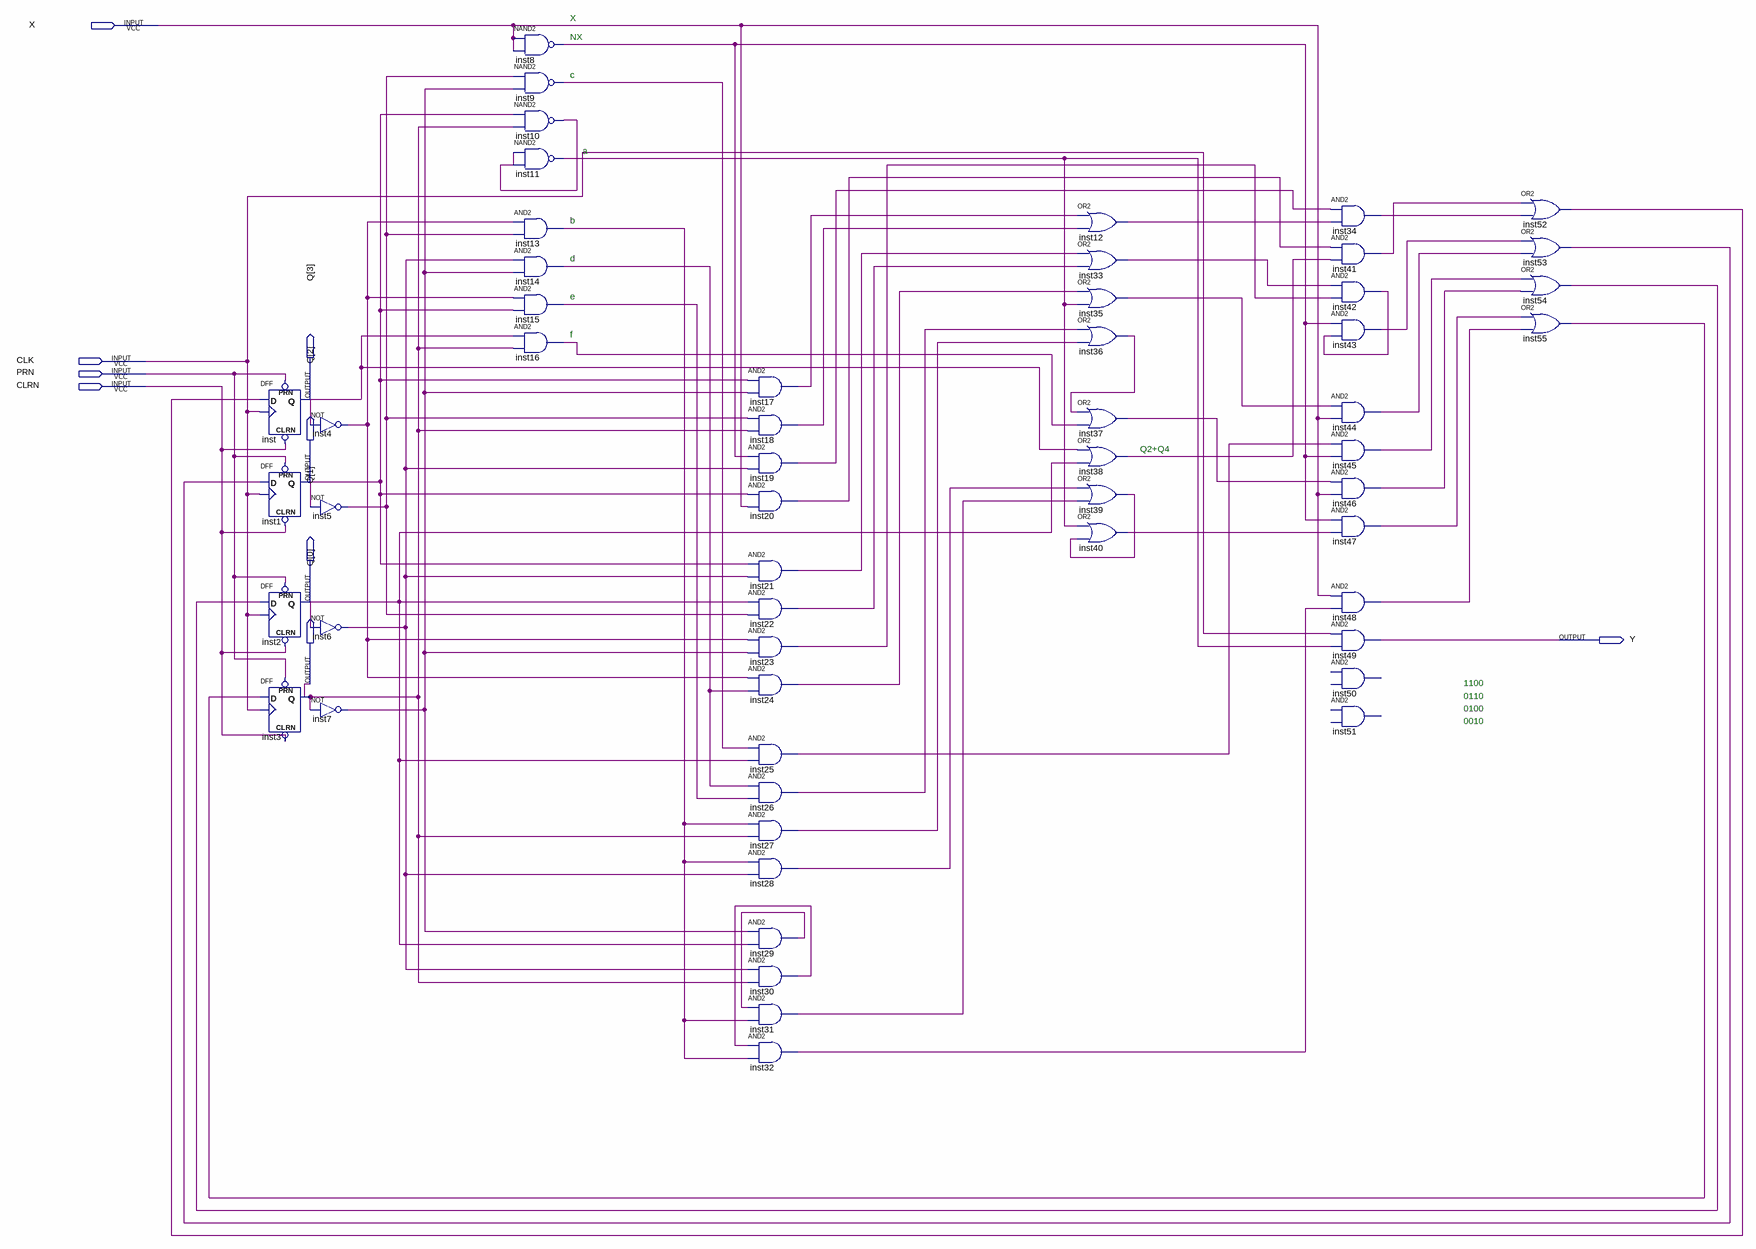
[diagram p0: schematic sheet]
// Quartus schematic lab_work2_v4_COURSE_WORK_STATE_MACHINE.bdf as structural Verilog: 56 symbols, 9 pins
module lab_work2_v4_COURSE_WORK_STATE_MACHINE (
  input  X,
  input  CLK,
  input  PRN,
  input  CLRN,
  output [3:0] Q,
  output Y
);

  wire inst4_out, inst5_out, inst6_out, inst7_out, inst8_out, inst9_out, inst10_out, inst11_out, inst12_out,
       inst13_out, inst14_out, inst15_out, inst16_out, inst17_out, inst18_out, inst19_out, inst20_out,
       inst21_out, inst22_out, inst23_out, inst24_out, inst25_out, inst26_out, inst27_out, inst28_out,
       inst29_out, inst30_out, inst31_out, inst32_out, inst33_out, inst34_out, inst35_out, inst36_out,
       inst37_out, inst38_out, inst39_out, inst40_out, inst41_out, inst42_out, inst43_out, inst44_out,
       inst45_out, inst46_out, inst47_out, inst48_out, inst52_out, inst53_out, inst54_out, inst55_out;

  DFF inst (.CLRN(CLRN), .CLK(CLK), .D(inst52_out), .PRN(PRN), .Q(Q[3]));
  DFF inst1 (.CLRN(CLRN), .CLK(CLK), .D(inst53_out), .PRN(PRN), .Q(Q[2]));
  DFF inst2 (.CLRN(CLRN), .CLK(CLK), .D(inst54_out), .PRN(PRN), .Q(Q[1]));
  DFF inst3 (.CLRN(CLRN), .CLK(CLK), .D(inst55_out), .PRN(PRN), .Q(Q[0]));
  not inst4 (inst4_out, Q[3]);
  not inst5 (inst5_out, Q[2]);
  not inst6 (inst6_out, Q[1]);
  not inst7 (inst7_out, Q[0]);
  nand inst8 (inst8_out, X, X);
  nand inst9 (inst9_out, inst5_out, inst7_out);
  nand inst10 (inst10_out, Q[2], Q[0]);
  nand inst11 (inst11_out, inst10_out, inst10_out);
  and inst13 (inst13_out, inst4_out, inst5_out);
  and inst14 (inst14_out, inst6_out, inst7_out);
  and inst15 (inst15_out, inst4_out, Q[2]);
  and inst16 (inst16_out, Q[3], Q[0]);
  and inst17 (inst17_out, Q[2], inst7_out);
  and inst18 (inst18_out, inst5_out, Q[0]);
  and inst19 (inst19_out, inst8_out, inst6_out);
  and inst20 (inst20_out, Q[2], X);
  and inst21 (inst21_out, Q[2], inst6_out);
  and inst22 (inst22_out, Q[1], inst5_out);
  and inst23 (inst23_out, inst4_out, inst7_out);
  and inst24 (inst24_out, inst4_out, inst14_out);
  and inst25 (inst25_out, inst9_out, Q[1]);
  and inst26 (inst26_out, inst14_out, inst15_out);
  and inst27 (inst27_out, inst13_out, Q[0]);
  and inst28 (inst28_out, inst13_out, inst6_out);
  and inst29 (inst29_out, inst7_out, Q[1]);
  and inst30 (inst30_out, inst6_out, Q[0]);
  and inst31 (inst31_out, inst29_out, inst13_out);
  and inst32 (inst32_out, inst30_out, inst13_out);
  or inst12 (inst12_out, inst17_out, inst18_out);
  or inst33 (inst33_out, inst21_out, inst22_out);
  or inst35 (inst35_out, inst24_out, inst11_out);
  or inst36 (inst36_out, inst26_out, inst27_out);
  or inst37 (inst37_out, inst36_out, inst16_out);
  or inst38 (inst38_out, Q[3], Q[1]);
  or inst39 (inst39_out, inst28_out, inst31_out);
  or inst40 (inst40_out, inst11_out, inst39_out);
  and inst34 (inst34_out, inst19_out, inst12_out);
  and inst41 (inst41_out, inst20_out, inst38_out);
  and inst42 (inst42_out, inst33_out, inst23_out);
  and inst43 (inst43_out, inst8_out, inst42_out);
  and inst44 (inst44_out, inst35_out, X);
  and inst45 (inst45_out, inst25_out, inst8_out);
  and inst46 (inst46_out, inst37_out, X);
  and inst47 (inst47_out, inst8_out, inst40_out);
  and inst48 (inst48_out, X, inst32_out);
  and inst49 (Y, CLK, inst11_out);
  // AND2 inst50 is placed but not wired
  // AND2 inst51 is placed but not wired
  or inst52 (inst52_out, inst41_out, inst34_out);
  or inst53 (inst53_out, inst43_out, inst44_out);
  or inst54 (inst54_out, inst45_out, inst46_out);
  or inst55 (inst55_out, inst47_out, inst48_out);

  // Notes on the sheet:
  //   X
  //   NX
  //   c
  //   a
  //   b
  //   d
  //   e
  //   f
  //   Q2+Q4
  //   1100
  //   0110
  //   0100
  //   0010
endmodule
